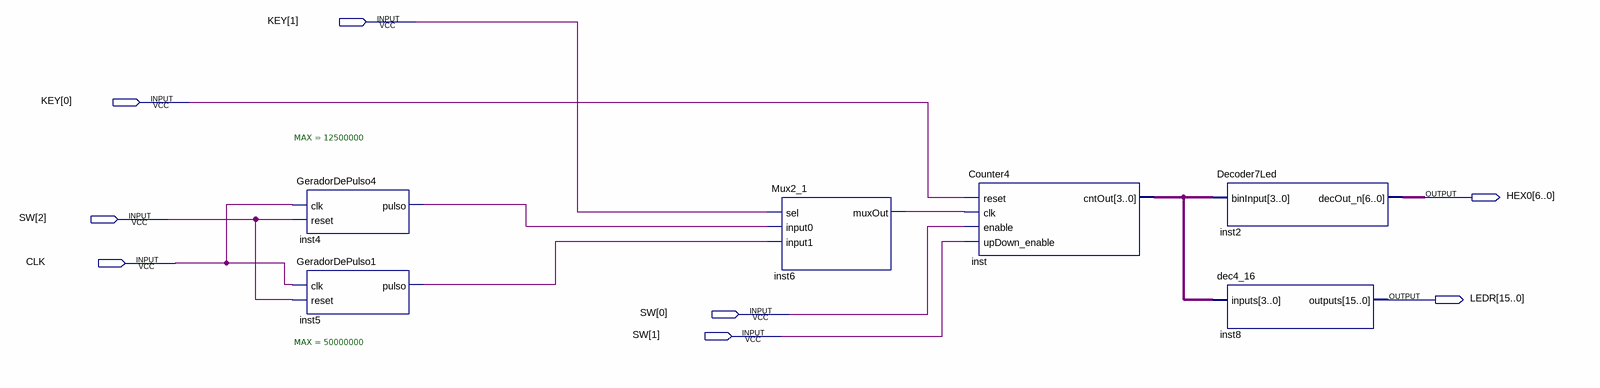
[diagram p0: schematic sheet]
// Quartus schematic miniprojeto.bdf as structural Verilog: 6 symbols, 8 pins
module miniprojeto (
  input  [1:0] KEY,
  input  [2:0] SW,
  input  CLK,
  output [6:0] HEX0,
  output [15:0] LEDR
);

  wire inst4_pulso, inst5_pulso, inst6_muxout;
  wire [3:0] inst_cntout;

  GeradorDePulso4 #(.MAX(12500000)) inst4 (.clk(CLK), .reset(SW[2]), .pulso(inst4_pulso));
  GeradorDePulso1 #(.MAX(50000000)) inst5 (.clk(CLK), .reset(SW[2]), .pulso(inst5_pulso));
  Mux2_1 inst6 (.sel(KEY[1]), .input0(inst4_pulso), .input1(inst5_pulso), .muxOut(inst6_muxout));
  Counter4 inst (.reset(KEY[0]), .clk(inst6_muxout), .enable(SW[0]), .upDown_enable(SW[1]), .cntOut(inst_cntout));
  Decoder7Led inst2 (.binInput(inst_cntout), .decOut_n(HEX0));
  dec4_16 inst8 (.inputs(inst_cntout), .outputs(LEDR));
endmodule
